# Altium schematic sheet SDEC944-xD_T‚l‚information.SchDoc: Téléinformation
size 393 x 270 mm; CompanyName: Seccom; Address1: 521, rue du capt. François Garbit; Address2: 69440 Mornant; Address3: seccom@seccom.fr; Address4: www.seccom.fr; DocumentNumber: 9; SheetNumber: 9; SheetTotal: 22; PageSetup: Record=PageOptions|CenterHorizontal=True|CenterVertical=True|PrintScale=0.72|XCorrection=1.00|YCorrection=1.00|PrintKind=0|BorderSize=5000000|LeftOffset=0|BottomOffset=0|Orientation=2|PaperLength=1000|PaperWidth=1000|Scale=100|PaperSource=7|PrintQuality=-4|MediaType=1|DitherType=10|PaperKind=A4|PrintScaleMode=1
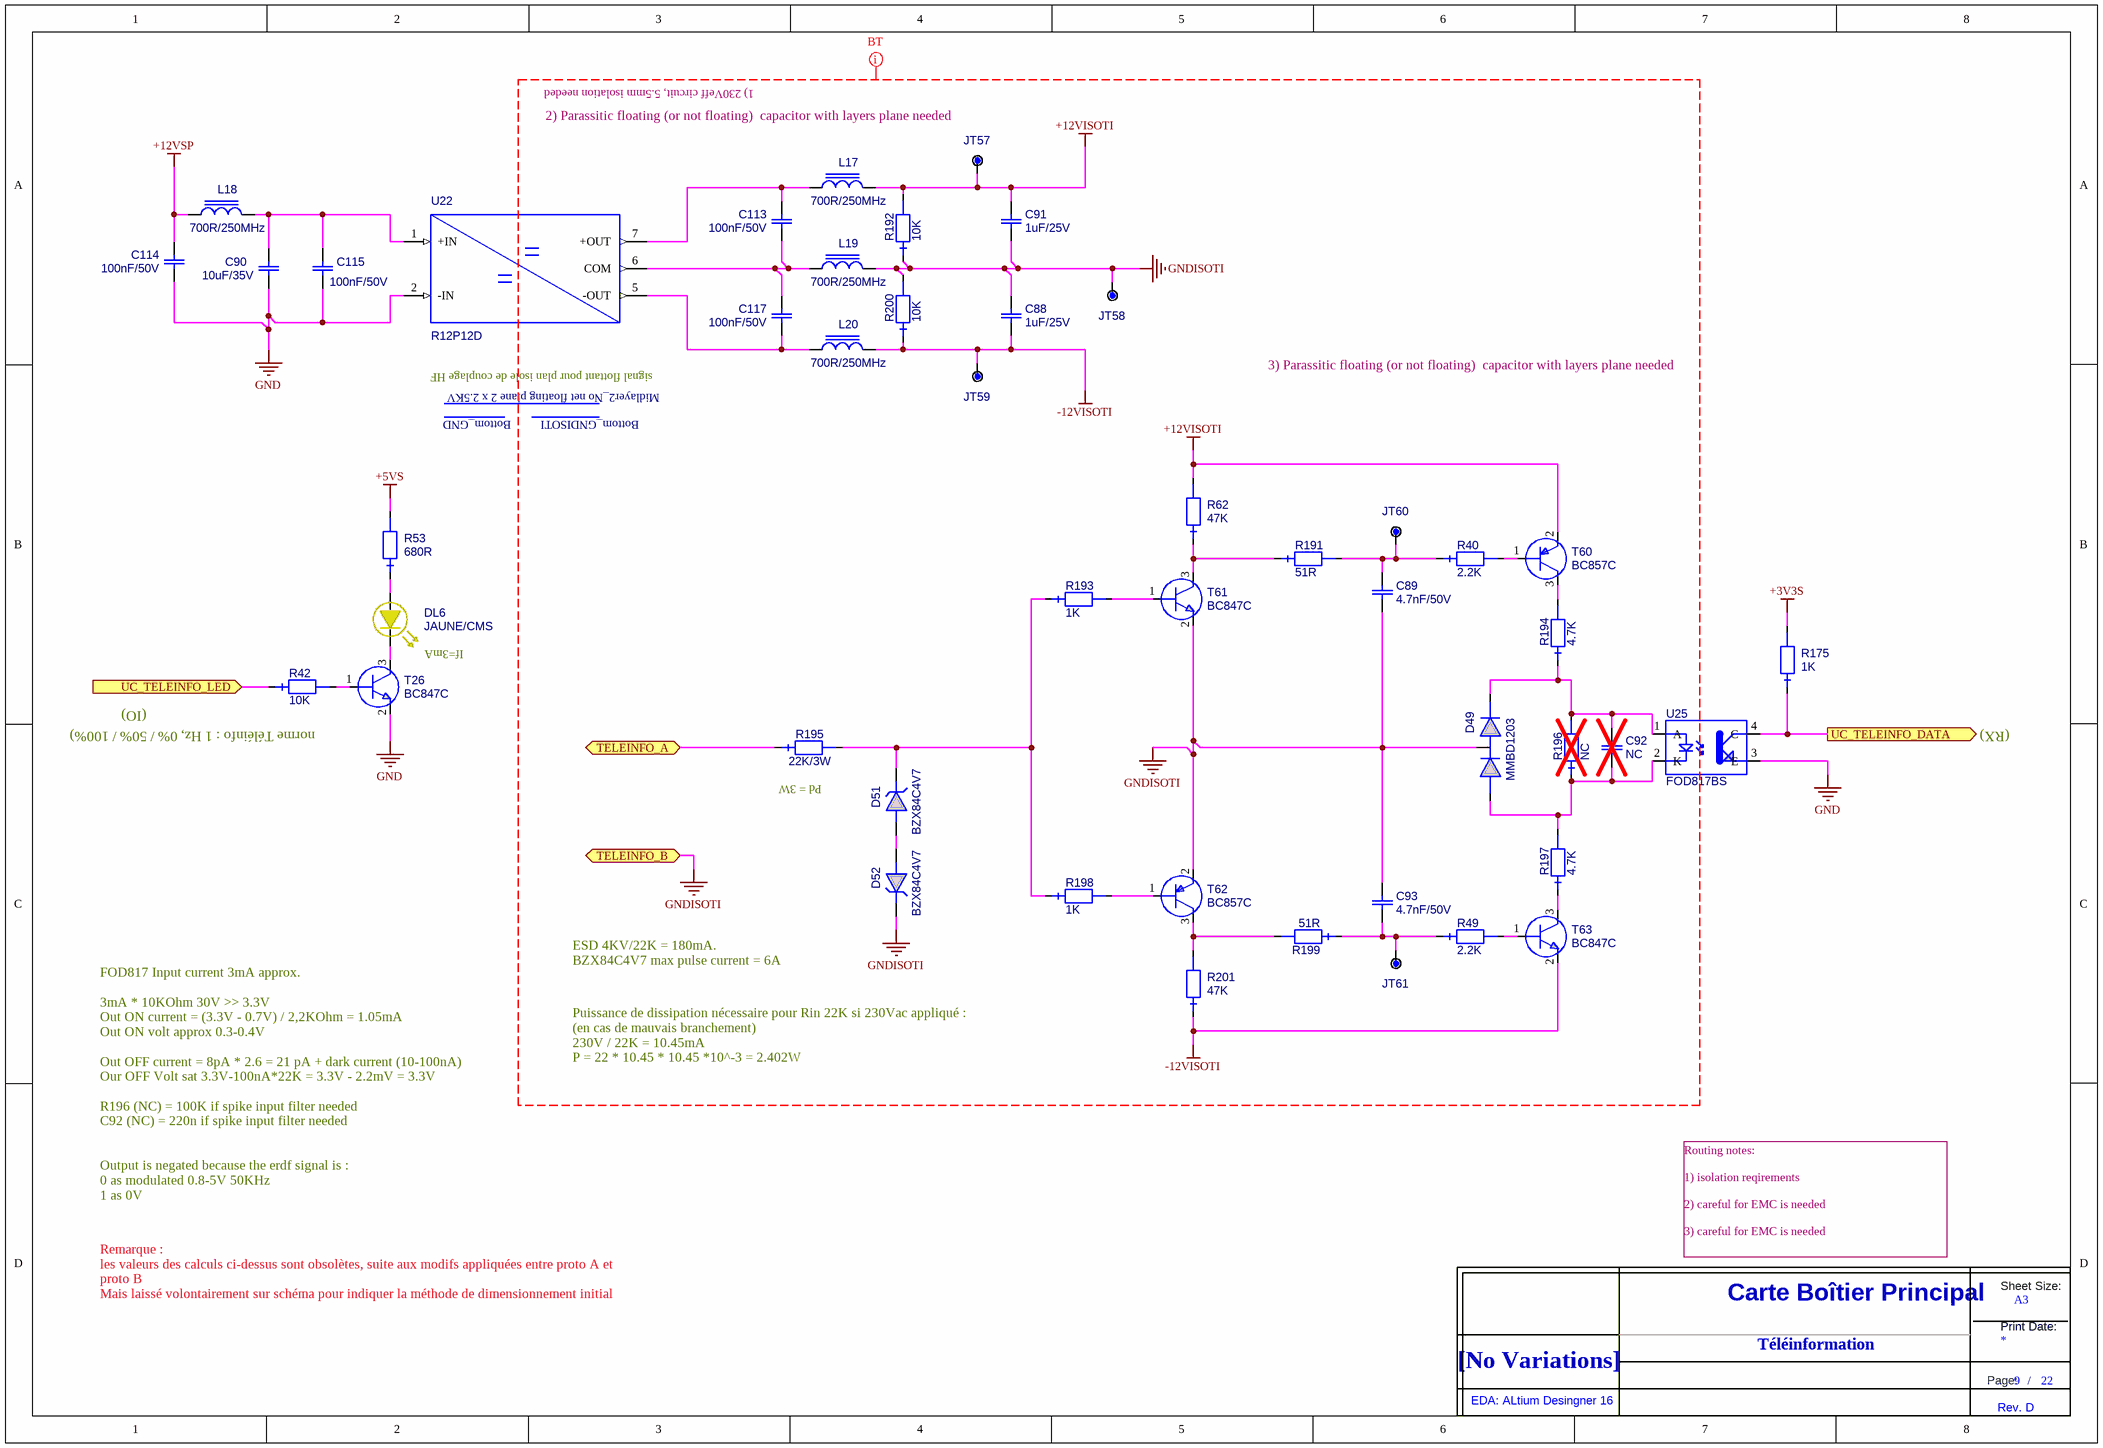
[diagram p0: SDEC944-xD_T‚l‚information.SchDoc]

## Parts
C88  value 1uF/25V  [0805_ReflowSoldering_CAP]  (hidden comment: C_0805_X5R_10%_1U-25V)
C89  value 4.7nF/50V  [0603_ReflowSoldering_CAP]  (hidden comment: C_0603_X7R_10%_4.7N-50V)
C90  value 10uF/35V  [1210_ReflowSoldering_CAP]  (hidden comment: C_1210_X5R_10%_10U-35V)
C91  value 1uF/25V  [0805_ReflowSoldering_CAP]  (hidden comment: C_0805_X5R_10%_1U-25V)
C92  value NC  [0603_ReflowSoldering_CAP]  (hidden comment: C_0603_NC)  (no BOM)
C93  value 4.7nF/50V  [0603_ReflowSoldering_CAP]  (hidden comment: C_0603_X7R_10%_4.7N-50V)
C113  value 100nF/50V  [0603_ReflowSoldering_CAP]  (hidden comment: C_0603_X7R_10%_100N-50V)
C114  value 100nF/50V  [0603_ReflowSoldering_CAP]  (hidden comment: C_0603_X7R_10%_100N-50V)
C115  value 100nF/50V  [0603_ReflowSoldering_CAP]  (hidden comment: C_0603_X7R_10%_100N-50V)
C117  value 100nF/50V  [0603_ReflowSoldering_CAP]  (hidden comment: C_0603_X7R_10%_100N-50V)
D49  MMBD1203  [SOT23_3L_ReflowSoldering]
D51  BZX84C4V7  [SOT23_3L_ReflowSoldering]
D52  BZX84C4V7  [SOT23_3L_ReflowSoldering]
DL6  value JAUNE/CMS  [LED_0805_KPx_YELLOW]  (hidden comment: LED_0805_JAUNE_KP2012SYC)
JT57  POINT_TEST_PAD_40MIL  [PAD_CL5_E40X40Y17D]  (value not drawn)  (no BOM)
JT58  POINT_TEST_PAD_40MIL  [PAD_CL5_E40X40Y17D]  (value not drawn)  (no BOM)
JT59  POINT_TEST_PAD_40MIL  [PAD_CL5_E40X40Y17D]  (value not drawn)  (no BOM)
JT60  POINT_TEST_PAD_40MIL  [PAD_CL5_E40X40Y17D]  (value not drawn)  (no BOM)
JT61  POINT_TEST_PAD_40MIL  [PAD_CL5_E40X40Y17D]  (value not drawn)  (no BOM)
L17  value 700R/250MHz  [0603_ReflowSoldering_CAP]  (hidden comment: IND_FERRITE_0603_742792643)
L18  value 700R/250MHz  [0603_ReflowSoldering_CAP]  (hidden comment: IND_FERRITE_0603_742792643)
L19  value 700R/250MHz  [0603_ReflowSoldering_CAP]  (hidden comment: IND_FERRITE_0603_742792643)
L20  value 700R/250MHz  [0603_ReflowSoldering_CAP]  (hidden comment: IND_FERRITE_0603_742792643)
R40  value 2.2K  [0603_ReflowSoldering_RES]  (hidden comment: RES_0603_1%_100PPM_2.2K)
R42  value 10K  [0603_ReflowSoldering_RES]  (hidden comment: RES_0603_1%_100PPM_10K)
R49  value 2.2K  [0603_ReflowSoldering_RES]  (hidden comment: RES_0603_1%_100PPM_2.2K)
R53  value 680R  [0603_ReflowSoldering_RES]  (hidden comment: RES_0603_1%_100PPM_680R)
R62  value 47K  [0603_ReflowSoldering_RES]  (hidden comment: RES_0603_1%_100PPM_47K)
R175  value 1K  [0603_ReflowSoldering_RES]  (hidden comment: RES_0603_1%_100PPM_1K)
R191  value 51R  [0603_ReflowSoldering_RES]  (hidden comment: RES_0603_1%_100PPM_51R)
R192  value 10K  [0603_ReflowSoldering_RES]  (hidden comment: RES_0603_1%_100PPM_10K)
R193  value 1K  [0603_ReflowSoldering_RES]  (hidden comment: RES_0603_1%_100PPM_1K)
R194  value 4.7K  [0603_ReflowSoldering_RES]  (hidden comment: RES_0603_1%_100PPM_4.7K)
R195  value 22K/3W  [RES_MOS3]  (hidden comment: RES_MOS3_5%_300PPM_22K_700V)
R196  value NC  [0603_ReflowSoldering_RES]  (hidden comment: RES_0603_NC)  (no BOM)
R197  value 4.7K  [0603_ReflowSoldering_RES]  (hidden comment: RES_0603_1%_100PPM_4.7K)
R198  value 1K  [0603_ReflowSoldering_RES]  (hidden comment: RES_0603_1%_100PPM_1K)
R199  value 51R  [0603_ReflowSoldering_RES]  (hidden comment: RES_0603_1%_100PPM_51R)
R200  value 10K  [0603_ReflowSoldering_RES]  (hidden comment: RES_0603_1%_100PPM_10K)
R201  value 47K  [0603_ReflowSoldering_RES]  (hidden comment: RES_0603_1%_100PPM_47K)
T26  BC847C  [SOT23_3L_ReflowSoldering]
T60  BC857C  [SOT23_3L_ReflowSoldering]
T61  BC847C  [SOT23_3L_ReflowSoldering]
T62  BC857C  [SOT23_3L_ReflowSoldering]
T63  BC847C  [SOT23_3L_ReflowSoldering]
Title_new  DNI  (value not drawn)  (graphical)
U22  value R12P12D  [DCDC_SIP_1W_19.5x9.8_h12.5]  (hidden comment: DCDC_+12V_-12V_1W_R12P12D)
U25  value FOD817BS  [OPTO_FOD817BS_ReflowSoldering]  (hidden comment: OPTO_FOD817BS)

## Ports
TELEINFO_A (bidir), TELEINFO_B (bidir), UC_TELEINFO_DATA (out), UC_TELEINFO_LED (in)

## Nets
+3V3S: R175.2
+5VS: R53.2
+12VISOTI: C91.2 JT57.1 L17.2 R62.2 R192.2 T60.2(E)
+12VSP: C114.1 L18.1
-12VISOTI: C88.1 JT59.1 L20.2 R200.1 R201.1 T63.2(E)
GND: C90.1 C114.2 C115.2 T26.2(E) U22.2(-IN) U25.3(E)
GNDISOTI: C88.2 C89.1 C91.1 C93.2 D49.3 D52.3 JT58.1 L19.2 R192.1 R200.2 T61.2(E) T62.2(E) ; port TELEINFO_B
TELEINFO_A: R195.1 ; port TELEINFO_A
UC_TELEINFO_DATA: R175.1 U25.4(C) ; port UC_TELEINFO_DATA
UC_TELEINFO_LED: R42.1 ; port UC_TELEINFO_LED
NetC89_2: C89.2 JT60.1 R40.1 R191.2
NetC90_2: C90.2 C115.1 L18.2 U22.1(+IN)
NetC92_1: C92.1 D49.1 R196.1 R197.2 U25.2(K)
NetC92_2: C92.2 D49.2 R194.1 R196.2 U25.1(A)
NetC93_1: C93.1 JT61.1 R49.1 R199.1
NetC113_1: C113.1 L17.1 U22.7(+OUT)
NetC113_2: C113.2 C117.1 L19.1 U22.6(COM)
NetC117_2: C117.2 L20.1 U22.5(-OUT)
NetD51_1: D51.1 D52.1
NetD51_3: D51.3 R193.1 R195.2 R198.1
NetDL6_A: DL6.A R53.1
NetDL6_K: DL6.K T26.3(C)
NetR40_2: R40.2 T60.1(B)
NetR42_2: R42.2 T26.1(B)
NetR49_2: R49.2 T63.1(B)
NetR62_1: R62.1 R191.1 T61.3(C)
NetR193_2: R193.2 T61.1(B)
NetR194_2: R194.2 T60.3(C)
NetR197_1: R197.1 T63.3(C)
NetR198_2: R198.2 T62.1(B)
NetR199_2: R199.2 R201.2 T62.3(C)

Not connected (* = marked no-connect by the designer): D51 2; D52 2

## Layout directives
net class BT: +12VISOTI, -12VISOTI, GNDISOTI

## Notes on the sheet
- 1) 230Veff circuit, 5.5mm isolation needed
- (near JT57) 2) Parassitic floating (or not floating)  capacitor with layers plane needed
- signal flottant pour plan isole de couplage HF
- Midlayer2_No net floating plane 2 x 2.5KV
- 3) Parassitic floating (or not floating)  capacitor with layers plane needed
- Bottom_GND
- Bottom_GNDISOTI
- If=3mA
- (IO)
- norme Téléinfo : 1 Hz, 0% / 50% / 100%)
- (RX)
- (near R195) Pd = 3W
- ESD 4KV/22K = 180mA.
  BZX84C4V7 max pulse current = 6A
- Puissance de dissipation nécessaire pour Rin 22K si 230Vac appliqué :
  (en cas de mauvais branchement)
  230V / 22K = 10.45mA
  P = 22 * 10.45 * 10.45 *10^-3 = 2.402W
- FOD817 Input current 3mA approx.
  3mA * 10KOhm 30V >> 3.3V
  Out ON current = (3.3V - 0.7V) / 2,2KOhm = 1.05mA
  Out ON volt approx 0.3-0.4V
  Out OFF current = 8pA * 2.6 = 21 pA + dark current (10-100nA)
  Our OFF Volt sat 3.3V-100nA*22K = 3.3V - 2.2mV = 3.3V
  R196 (NC) = 100K if spike input filter needed
  C92 (NC) = 220n if spike input filter needed
  Output is negated because the erdf signal is :
  0 as modulated 0.8-5V 50KHz
  1 as 0V
- Routing notes:
  1) isolation reqirements
  2) careful for EMC is needed
  3) careful for EMC is needed
- Remarque :
  les valeurs des calculs ci-dessus sont obsolètes, suite aux modifs appliquées entre proto A et proto B
  Mais laissé volontairement sur schéma pour indiquer la méthode de dimensionnement initial
- Téléinformation
- (in symbol Title_new) Sheet Size:; Carte Boîtier Principal; A3; Print Date:; [No Variations]; Page:; /; EDA: ALtium Desingner 16; Rev. D

## Library data of the parts
C88 C91 = C_0805_X5R_10%_1U-25V: Condensateur céramique, X5R, 10%, CMS 0805; Creation: FB (07/03/12); Reference: 001834/00; Boitier: 0805; Remarque: {Remarque}; Coeff: 1; Fabricant: AVX; Ref Fab: 08053D105KAT2A; Verification: *; ComponentLink1URL: O:\_Documentation\Datasheets\AVX\Condensateurs_CMS_Ceramic_X5R.pdf; ComponentLink2URL: o:\_Documentation\Datasheets\_Boitiers\PASSIF_CMS\RC_0805_(2x1,25)_(Schneider).pdf; Config: *; ComponentLink1Description: Datasheet; ComponentLink2Description: Datasheet Boitier; Supplier Part Number 1: 1327695; Supplier Part Number 2: 6983409; Supplier 1: Farnell; Supplier 2: Radiospares
C89 C93 = C_0603_X7R_10%_4.7N-50V: Condensateur céramique, X7R, 10%, CMS 0603, 4,7nF/50V; Creation: PDP (30/08/12); Boitier: 0603; Remarque: {Remarque}; Fabricant: Kemet; Ref Fab: C0603C472K5RAC; Coeff: 1; ComponentLink1URL: O:\_Documentation\Datasheets\Kemet\Condos_Ceramic_CMS.pdf; ComponentLink2URL: o:\_Documentation\Datasheets\_BOITIERS\PASSIF_CMS\; Config: *; ComponentLink1Description: Datasheet; ComponentLink2Description: Datasheet Boitier; Supplier 1: Farnell; Supplier Part Number 1: 4528384; Supplier 2: Mouser; Supplier Part Number 2: 80-C0603C472K5RAUTO
C90 = C_1210_X5R_10%_10U-35V: Condensateur céramique, X5R, 10%, CMS 1210; Creation: LJ (09/02/09); Reference: 000265/00; Boitier: 1210; Remarque: {Remarque}; Coeff: 1; Fabricant: Taiyo Yuden; Ref Fab: GMK325BJ106KN-T; Verification: *; ComponentLink1URL: o:\_Documentation\Datasheets\TaiyoYuden\High_Value_Multilayer_Ceramic_Caps.pdf; ComponentLink2URL: o:\_Documentation\Datasheets\_Boitiers\PASSIF_CMS\C_1210_(3,2x2,5)_(Schneider).pdf; Config: *; ComponentLink1Description: Datasheet; ComponentLink2Description: Datasheet Boitier
C92 = C_0603_NC: Condensateur, CMS 0603, NC; Creation: PDP (30/08/12); Boitier: 0603; Coeff: 1; ComponentLink2URL: o:\_Documentation\Datasheets\_BOITIERS\PASSIF_CMS\; ComponentLink2Description: Datasheet Boitier
C113-C115 C117 = C_0603_X7R_10%_100N-50V: Condensateur céramique, X7R, 10%, CMS 0603, 100nF/50V; Creation: FB (29/02/12); Boitier: 0603; Remarque: {Remarque}; Fabricant: Kemet; Ref Fab: C0603C104K5RAC; Coeff: 1; ComponentLink1URL: O:\_Documentation\Datasheets\Kemet\Condos_Ceramic_CMS.pdf; ComponentLink2URL: o:\_Documentation\Datasheets\_BOITIERS\PASSIF_CMS\; Config: *; ComponentLink1Description: Datasheet; ComponentLink2Description: Datasheet Boitier; Supplier 1: Farnell; Supplier Part Number 1: 1288255
D49 = MMBD1203: Diode de Redressement double, en série, Vrrm=100V, If=200mA, Vf=1V, rapide (trr=4ns), CMS; Creation: LJ (28/04/11); Reference: 001730/00; Boitier: SOT23_3L; Remarque: {Remarque}; Coeff: 1; Fabricant: Fairchild; ComponentLink1URL: o:\_Documentation\Datasheets\Fairchild\MMBD1201-2-3-4-5.pdf; ComponentLink2URL: o:\_Documentation\Datasheets\_BOITIERS\ACTIF_CMS\SOT\SOT_23_3P_(Schneider).PDF; Config: *; ComponentLink1Description: Datasheet; ComponentLink2Description: Datasheet Boitier; Supplier 1: Farnell; Supplier 2: Mouser; Supplier Part Number 1: 1700901; Supplier Part Number 2: 512-MMBD1203; Ref Fab: MMBD1203; Value: MMBD1203
D51 D52 = BZX84C4V7: Diode Zener, série BZX84C, 0.3W, +/-5%, 4.7V, CMS; Creation: LJ; Verification: LJ (25/02/02); Reference: 000212/00; Boitier: SOT23_3L; Remarque: {Remarque}; Coeff: 1; Fabricant: NXP; ComponentLink1URL: o:\_Documentation\Datasheets\NXP\BZX84_SERIES.pdf; ComponentLink2URL: o:\_Documentation\Datasheets\_BOITIERS\ACTIF_CMS\SOT\SOT_23_3P_(Schneider).PDF; Config: *; ComponentLink1Description: Datasheet; ComponentLink2Description: Datasheet Boitier; Ref Fab: BZX84C4V7; Supplier 1: Farnell; Supplier Part Number 1: 1081428; Supplier 2: Mouser; Supplier Part Number 2: 771-BZX84-C4V7-T/R; Value: BZX84C4V7
DL6 = LED_0805_JAUNE_KP2012SYC: LED CMS 0805, Jaune, Vf 2V@20mA (36-100mCd), 590nm, vue 120°; Creation: JPL (04/07/12); Boitier: 0805; Remarque: {Remarque}; Coeff: 1; Fabricant: Kingbright; Ref Fab: KP-2012SYC; Verification: *; Config: *; ComponentLink1Description: Datasheet; ComponentLink2Description: Datasheet Boitier; Supplier 1: Farnell; Supplier Part Number 1: 8529914
JT57-JT61 = POINT_TEST_PAD_40MIL: Point de test sur CI, pad de diamètre 1.016mm (40mils); Creation: FB (04/10/12); Remarque: {Remarque}; Coeff: 1; Value: POINT_TEST; Config: *; ComponentLink1Description: Datasheet; ComponentLink2Description: Datasheet Boitier
L17-L20 = IND_FERRITE_0603_742792643: Inductance à ferrite multicouches CMS, imp=700R@250MHz, +/-25%, Rdc=350mR, I=400mA; Creation: PDP (02/08/12); Boitier: 0603; Coeff: 1; Fabricant: Wurth Elektronik; ComponentLink1URL: o:\_Documentation\Datasheets\Murata\Ferrite_BLM21P.pdf; Config: *; ComponentLink1Description: Datasheet; ComponentLink2Description: Datasheet Boitier; Ref Fab: 742792643; Supplier 1: Farnell; Supplier Part Number 1: 1800349
R40 R49 = RES_0603_1%_100PPM_2.2K: Résistance, 0.100W, 1%, 100ppm, 75V, 2.2K; Creation: JPL (05/07/12); Boitier: 0603; Remarque: {Remarque}; Fabricant: Vishay; Ref Fab: CRCW06032K20FKEA; Coeff: 1; Verification: *; ComponentLink1URL: O:\_Documentation\Datasheets\Vishay\Resistances_D-CRCWe3.pdf; ComponentLink2URL: o:\_Documentation\Datasheets\_BOITIERS\PASSIF_CMS\; Config: *; ComponentLink1Description: Datasheet; ComponentLink2Description: Datasheet Boitier; Supplier 1: Farnell; Supplier 2: RadioSpares; Supplier Part Number 1: 1469765; Supplier Part Number 2: 6790112
R42 R192 R200 = RES_0603_1%_100PPM_10K: Résistance, 0.100W, 1%, 100ppm, 75V, 10K; Creation: JPL (05/07/12); Boitier: 0603; Remarque: {Remarque}; Fabricant: Vishay; Ref Fab: CRCW060310K0FKEA; Coeff: 1; Verification: *; ComponentLink1URL: O:\_Documentation\Datasheets\Vishay\Resistances_D-CRCWe3.pdf; ComponentLink2URL: o:\_Documentation\Datasheets\_BOITIERS\PASSIF_CMS\; Config: *; ComponentLink1Description: Datasheet; ComponentLink2Description: Datasheet Boitier; Supplier 1: Farnell; Supplier 2: RadioSpares; Supplier Part Number 1: 1469748; Supplier Part Number 2: 6789667
R53 = RES_0603_1%_100PPM_680R: Résistance, 0.100W, 1%, 100ppm, 75V, 680R; Creation: FB (02/08/12); Boitier: 0603; Remarque: {Remarque}; Fabricant: Vishay; Ref Fab: CRCW0603680RFKEA; Coeff: 1; Verification: *; ComponentLink1URL: O:\_Documentation\Datasheets\Vishay\Resistances_D-CRCWe3.pdf; ComponentLink2URL: o:\_Documentation\Datasheets\_BOITIERS\PASSIF_CMS\; Config: *; ComponentLink1Description: Datasheet; ComponentLink2Description: Datasheet Boitier; Supplier 1: Farnell; Supplier Part Number 1: 1469834; Supplier 2: Mouser; Supplier Part Number 2: 71-CRCW0603-680-E3
R62 R201 = RES_0603_1%_100PPM_47K: Résistance, 0.100W, 1%, 100ppm, 75V, 47K; Creation: JPL (05/07/12); Boitier: 0603; Remarque: {Remarque}; Fabricant: Vishay; Ref Fab: CRCW060347K0FKEA; Coeff: 1; Verification: *; ComponentLink1URL: O:\_Documentation\Datasheets\Vishay\Resistances_D-CRCWe3.pdf; ComponentLink2URL: o:\_Documentation\Datasheets\_BOITIERS\PASSIF_CMS\; Config: *; ComponentLink1Description: Datasheet; ComponentLink2Description: Datasheet Boitier; Supplier 1: Farnell; Supplier 2: RadioSpares; Supplier Part Number 1: 1469811; Supplier Part Number 2: 6790425
R175 R193 R198 = RES_0603_1%_100PPM_1K: Résistance, 0.100W, 1%, 100ppm, 75V, 1K; Creation: JPL (05/07/12); Boitier: 0603; Remarque: {Remarque}; Fabricant: Vishay; Ref Fab: CRCW06031K00FKEA; Coeff: 1; Verification: *; ComponentLink1URL: O:\_Documentation\Datasheets\Vishay\Resistances_D-CRCWe3.pdf; ComponentLink2URL: o:\_Documentation\Datasheets\_BOITIERS\PASSIF_CMS\; Config: *; ComponentLink1Description: Datasheet; ComponentLink2Description: Datasheet Boitier; Supplier 1: Farnell; Supplier 2: RadioSpares; Supplier Part Number 1: 1469740; Supplier Part Number 2: 6789875
R191 R199 = RES_0603_1%_100PPM_51R: Résistance, 0.100W, 1%, 100ppm, 75V, 51R; Creation: JPL (05/07/12); Boitier: 0603; Remarque: {Remarque}; Fabricant: Vishay; Ref Fab: CRCW060351R0FKEA; Coeff: 1; Verification: *; ComponentLink1URL: O:\_Documentation\Datasheets\Vishay\Resistances_D-CRCWe3.pdf; ComponentLink2URL: o:\_Documentation\Datasheets\_BOITIERS\PASSIF_CMS\; Config: *; ComponentLink1Description: Datasheet; ComponentLink2Description: Datasheet Boitier; Supplier 1: Farnell; Supplier 2: Mouser; Supplier Part Number 1: 1652889; Supplier Part Number 2: 71-CRCW0603-51-E3
R194 R197 = RES_0603_1%_100PPM_4.7K: Résistance, 0.100W, 1%, 100ppm, 75V, 4.7K; Creation: JPL (05/07/12); Boitier: 0603; Remarque: {Remarque}; Fabricant: Vishay; Ref Fab: CRCW06034K70FKEA; Coeff: 1; Verification: *; ComponentLink1URL: O:\_Documentation\Datasheets\Vishay\Resistances_D-CRCWe3.pdf; ComponentLink2URL: o:\_Documentation\Datasheets\_BOITIERS\PASSIF_CMS\; Config: *; ComponentLink1Description: Datasheet; ComponentLink2Description: Datasheet Boitier; Supplier 1: Farnell; Supplier 2: RadioSpares; Supplier Part Number 1: 1469807; Supplier Part Number 2: 6790484
R195 = RES_MOS3_5%_300PPM_22K_700V: Résistance Metal Oxide MOS3, 3W, 5%, 300ppm, 700V, 22K; Creation: PDP; Coeff: 1; Fabricant: KOA Speer; Ref Fab: MOS3CT631R223J; Boitier: MOS3; ComponentLink1URL: o:\_Documentation\Datasheets\KOA\MOS.pdf; ComponentLink2URL: o:\_Documentation\Datasheets\KOA\MOS.pdf; Config: *; ComponentLink1Description: Datasheet; ComponentLink2Description: Datasheet Boitier; Supplier 1: Mouser; Supplier Part Number 1: 660-MOS3CT631R223J
R196 = RES_0603_NC: Résistance, 0.100W, NC; Creation: PDP (30/08/12); Boitier: 0603; Remarque: {Remarque}; Coeff: 1; ComponentLink2URL: o:\_Documentation\Datasheets\_BOITIERS\PASSIF_CMS\; Config: *; ComponentLink2Description: Datasheet Boitier
T26 = BC847C: Transistor NPN, Vce=50V, Ic=0.1A, hfe=420~800, 0.25W, CMS; Creation: GO (08/07/05); Verification: LJ (21/07/05); Reference: 000329/00; Boitier: SOT23_3L; Remarque: Complementaires aux BC856-860; Fabricant: NXP; Coeff: 1; Ref Fab: BC847C; ComponentLink1URL: O:\_Documentation\Datasheets\NXP\BC847.pdf; ComponentLink2URL: o:\_Documentation\Datasheets\_BOITIERS\ACTIF_CMS\SOT\SOT_23_3P_(Schneider).PDF; Config: *; ComponentLink1Description: Datasheet; Value: BC847C; Supplier 1: Farnell; Supplier Part Number 1: 1081235; ComponentLink2Description: Datasheet Boitier
T60 T62 = BC857C: Transistor PNP, Vce=45V, Ic=0.1A, hfe=420~800, 0.3W, CMS; Creation: LJ; Verification: LJ (27/10/03); Reference: 000483/00; Boitier: SOT23_3L; Remarque: Complementaires aux BC846-850; Coeff: 1; Fabricant: NXP; ComponentLink1URL: O:\_Documentation\Datasheets\NXP\BC856_BC857_BC858.pdf; ComponentLink2URL: o:\_Documentation\Datasheets\_BOITIERS\ACTIF_CMS\SOT\SOT_23_3P_(Schneider).PDF; Config: *; ComponentLink1Description: Datasheet; Ref Fab: BC857C; ComponentLink2Description: Datasheet Boitier; Supplier 1: Farnell; Supplier Part Number 1: 8734771; Value: BC857C
T61 T63 = BC847C: Transistor NPN, Vce=50V, Ic=0.1A, hfe=420~800, 0.25W, CMS; Creation: GO (08/07/05); Verification: LJ (21/07/05); Reference: 000329/00; Boitier: SOT23_3L; Remarque: Complementaires aux BC856-860; Coeff: 1; Fabricant: NXP; ComponentLink1URL: O:\_Documentation\Datasheets\NXP\BC847.pdf; ComponentLink2URL: o:\_Documentation\Datasheets\_BOITIERS\ACTIF_CMS\SOT\SOT_23_3P_(Schneider).PDF; Config: *; ComponentLink1Description: Datasheet; Supplier 1: Farnell; Ref Fab: BC847C; Value: BC847C; Supplier Part Number 1: 1081235; ComponentLink2Description: Datasheet Boitier
Title_new = Title_new
U22 = DCDC_+12V_-12V_1W_R12P12D: Convertisseur DC/DC, 1W, Vin=12V, +Vout=+12V/0.42A, -Vout=-12V/0.42A, boitier SIP7, Viso=6.4kV/1s; Creation: ZA (04/10/12); Boitier: DCDC_SIP_19.5x9.8_h12.5mm; Fabricant: Recom; Coeff: 1; Ref Fab: R12P12D; ComponentLink1URL: o:\_Documentation\Datasheets\Recom\Convertisseur_DCDC_RxxPxx.pdf; Config: *; ComponentLink1Description: Datasheet; ComponentLink2Description: Datasheet Boitier; Supplier 1: Mouser; Supplier Part Number 1: 919-R12P12D
U25 = OPTO_FOD817BS: Optocouleur simple, IR GaAs, Viso=5kVrms, If=50mA, Vce=70V, Ic=50mA, CTR=130-260, CMS; Creation: FB (10/07/12); Boitier: MDIP4-SM; Remarque: {Remarque}; Coeff: 1; Fabricant: Fairchild; Verification: *; ComponentLink1URL: O:\_Documentation\Datasheets\Fairchild\FOD814A.pdf; ComponentLink2URL: o:\_Documentation\Datasheets\; Config: *; ComponentLink1Description: Datasheet; ComponentLink2Description: Datasheet Boitier; Ref Fab: FOD817BS; Supplier Part Number 1: 512-FOD817BS; Supplier 1: Mouser